# Altium schematic sheet TC264Sheet.SchDoc
size A3
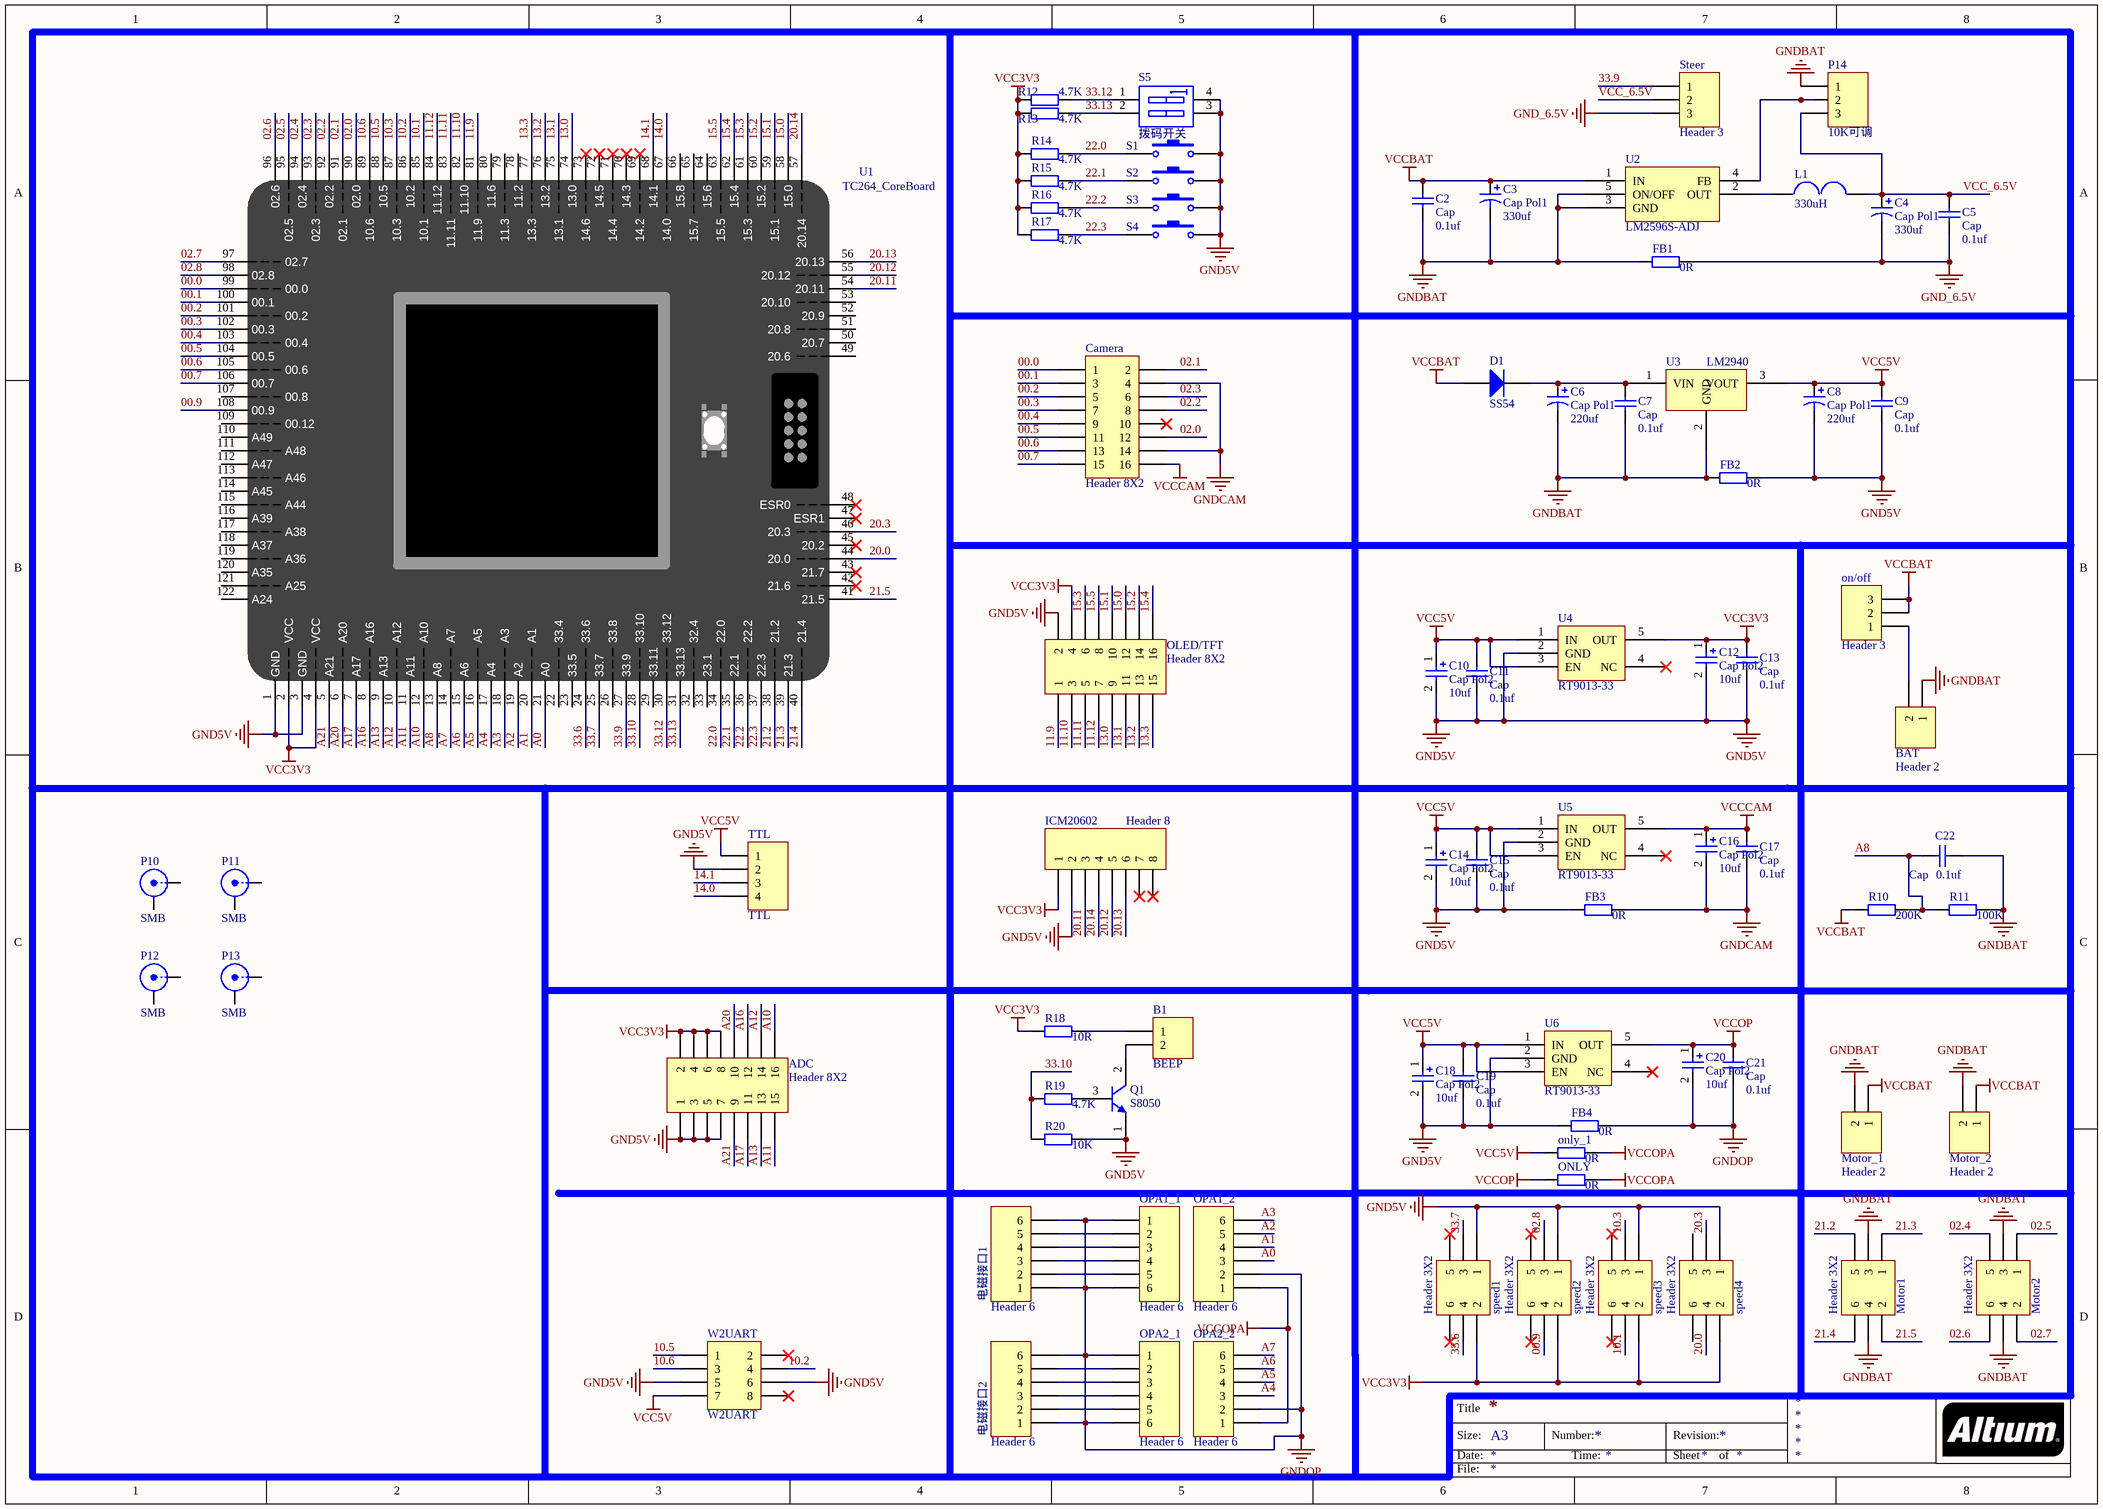
[diagram p0: TC264Sheet.SchDoc]

## Parts
ADC  Header 8X2  [HDR2.54-M-LS-2x8P]
B1  BEEP  [9*11mm有源蜂鸣器]
BAT  Header 2  [电源端口]
C2  Cap  value 0.1uf  [0603电容_]
C3  Cap Pol1  value 330uf  [470UF]
C4  Cap Pol1  value 330uf  [470UF]
C5  Cap  value 0.1uf  [0603电容_]
C6  Cap Pol1  value 220uf  [470UF]
C7  Cap  value 0.1uf  [0603电容_]
C8  Cap Pol1  value 220uf  [470UF]
C9  Cap  value 0.1uf  [0603电容_]
C10  Cap Pol2  value 10uf  [10UF钽电容]
C11  Cap  value 0.1uf  [0603电容_]
C12  Cap Pol2  value 10uf  [10UF钽电容]
C13  Cap  value 0.1uf  [0603电容_]
C14  Cap Pol2  value 10uf  [10UF钽电容]
C15  Cap  value 0.1uf  [0603电容_]
C16  Cap Pol2  value 10uf  [10UF钽电容]
C17  Cap  value 0.1uf  [0603电容_]
C18  Cap Pol2  value 10uf  [10UF钽电容]
C19  Cap  value 0.1uf  [0603电容_]
C20  Cap Pol2  value 10uf  [10UF钽电容]
C21  Cap  value 0.1uf  [0603电容_]
C22  Cap  value 0.1uf  [0603电容_]
Camera  Header 8X2  [HDR2.54-M-LS-2x8P]
D1  SS54  [in5819_SLFK]
FB1  0R  [0603电阻_]
FB2  0R  [0603电阻_]
FB3  0R  [0603电阻_]
FB4  0R  [0603电阻_]
ICM20602  Header 8  [HDR1X8]
L1  330uH  [330uH]
Motor1  Header 3X2  [HDR2.54-M-LS-2x3P]
Motor2  Header 3X2  [HDR2.54-M-LS-2x3P]
Motor_1  Header 2  [电源端口]
Motor_2  Header 2  [电源端口]
OLED/TFT  Header 8X2  [HDR2.54-M-LS-2x8P]
on/off  Header 3  [小扭子开关]
ONLY  0R  [0603电阻_]
only_1  0R  [0603电阻_]
OPA1_1  Header 6  [HDR1X6]
OPA1_2  Header 6  [HDR1X6]
OPA2_1  Header 6  [HDR1X6]
OPA2_2  Header 6  [HDR1X6]
P10  SMB  [螺丝孔]
P11  SMB  [螺丝孔]
P12  SMB  [螺丝孔]
P13  SMB  [螺丝孔]
P14  10K可调  [白兰可调电阻]
Q1  S8050  [SI2302]
R10  200K  [0603电阻_]
R11  100K  [0603电阻_]
R12  4.7K  [0603电阻_]
R13  4.7K  [0603电阻_]
R14  4.7K  [0603电阻_]
R15  4.7K  [0603电阻_]
R16  4.7K  [0603电阻_]
R17  4.7K  [0603电阻_]
R18  10R  [0603电阻_]
R19  4.7K  [0603电阻_]
R20  10K  [0603电阻_]
S1  (no value)  [3*4*2贴片轻触按键]
S2  (no value)  [3*4*2贴片轻触按键]
S3  (no value)  [3*4*2贴片轻触按键]
S4  (no value)  [3*4*2贴片轻触按键]
S5  拨码开关  [2pin拨码开关2.54_SMT]
speed1  Header 3X2  [HDR2.54-M-LS-2x3P]
speed2  Header 3X2  [HDR2.54-M-LS-2x3P]
speed3  Header 3X2  [HDR2.54-M-LS-2x3P]
speed4  Header 3X2  [HDR2.54-M-LS-2x3P]
Steer  Header 3  [HDR1X3]
TTL  TTL  [HDR1X4]
U1  TC264_CoreBoard  [TC264_CoreBoard]
U2  LM2596S-ADJ  [TO263-5]
U3  LM2940  [LM2940-5.0]
U4  RT9013-33  [SOT-23-5]
U5  RT9013-33  [SOT-23-5]
U6  RT9013-33  [SOT-23-5]
W2UART  W2UART  [HDR2.54-M-LS-2x4P]
电磁接口1  Header 6  [HDR1X6]
电磁接口2  Header 6  [HDR1X6]

## Nets
GND5V: ADC.1 ADC.3 ADC.5 ADC.7 C8.2 C9.1 C10.2 C11.1 C12.2 C13.1 C14.2 C15.1 C18.2 C19.1 FB2.2 FB3.1 FB4.1 ICM20602.2 OLED/TFT.2 Q1.1(E) R20.2 S1.2 S2.2 S3.2 S4.2 S5.3(B2) S5.4(B1) speed1.1 speed2.1 speed3.1 speed4.1 TTL.2 U1.1(GND) U1.3(GND) U4.2(GND) U5.2(GND) U6.2(GND) W2UART.5 W2UART.6
GND_6.5V: C4.2 C5.1 FB1.2 Steer.3
GNDBAT: BAT.1 C2.1 C3.2 C6.2 C7.1 C22.1 FB1.1 FB2.1 Motor1.3 Motor1.4 Motor2.3 Motor2.4 Motor_1.2 Motor_2.2 P14.1 R11.2 U2.3(GND) U2.5(ON/OFF) U3.2(GND)
GNDCAM: C16.2 C17.1 Camera.4 Camera.14 FB3.2
GNDOP: C20.2 C21.1 FB4.2 OPA1_1.1 OPA1_1.6 OPA1_2.2 OPA2_1.1 OPA2_1.6 OPA2_2.2 电磁接口1.1 电磁接口1.6 电磁接口2.1 电磁接口2.6
VCC3V3: ADC.2 ADC.4 ADC.6 ADC.8 C12.1 C13.2 ICM20602.1 OLED/TFT.4 R12.1 R13.1 R14.1 R15.1 R16.1 R17.1 R18.1 speed1.2 speed2.2 speed3.2 speed4.2 U1.2(VCC) U1.4(VCC) U4.5(OUT)
VCC5V: C8.1 C9.2 C10.1 C11.2 C14.1 C15.2 C18.1 C19.2 only_1.1 TTL.1 U3.3(VOUT) U4.1(IN) U4.3(EN) U5.1(IN) U5.3(EN) U6.1(IN) U6.3(EN) W2UART.7
VCCBAT: C2.2 C3.1 D1.1(A) Motor_1.1 Motor_2.1 on/off.2 on/off.3 R10.1 U2.1(IN)
VCCCAM: C16.1 C17.2 Camera.16 U5.5(OUT)
VCCOP: C20.1 C21.2 ONLY.1 U6.5(OUT)
VCCOPA: ONLY.2 only_1.2 OPA1_2.1 OPA2_2.1
00.0: Camera.1 U1.99(00.0)
00.1: Camera.3 U1.100(00.1)
00.2: Camera.5 U1.101(00.2)
00.3: Camera.7 U1.102(00.3)
00.4: Camera.9 U1.103(00.4)
00.5: Camera.11 U1.104(00.5)
00.6: Camera.13 U1.105(00.6)
00.7: Camera.15 U1.106(00.7)
00.9: speed2.4 U1.108(00.9)
02.0: Camera.12 U1.90(02.0)
02.1: Camera.2 U1.91(02.1)
02.2: Camera.8 U1.92(02.2)
02.3: Camera.6 U1.93(02.3)
02.4: Motor2.5 U1.94(02.4)
02.5: Motor2.1 U1.95(02.5)
02.6: Motor2.6 U1.96(02.6)
02.7: Motor2.2 U1.97(02.7)
02.8: speed2.3 U1.98(02.8)
10.1: speed3.4 U1.85(10.1)
10.2: U1.86(10.2) W2UART.4
10.3: speed3.3 U1.87(10.3)
10.5: U1.88(10.5) W2UART.1
10.6: U1.89(10.6) W2UART.3
11.9: OLED/TFT.1 U1.81(11.9)
11.10: OLED/TFT.3 U1.82(11.10)
11.11: OLED/TFT.5 U1.83(11.11)
11.12: OLED/TFT.7 U1.84(11.12)
13.0: OLED/TFT.9 U1.74(13.0)
13.1: OLED/TFT.11 U1.75(13.1)
13.2: OLED/TFT.13 U1.76(13.2)
13.3: OLED/TFT.15 U1.77(13.3)
14.0: TTL.4 U1.67(14.0)
14.1: TTL.3 U1.68(14.1)
15.0: OLED/TFT.12 U1.58(15.0)
15.1: OLED/TFT.10 U1.59(15.1)
15.2: OLED/TFT.14 U1.60(15.2)
15.3: OLED/TFT.6 U1.61(15.3)
15.4: OLED/TFT.16 U1.62(15.4)
15.5: OLED/TFT.8 U1.63(15.5)
20.0: speed4.4 U1.44(20.0)
20.3: speed4.3 U1.46(20.3)
20.11: ICM20602.3 U1.54(20.11)
20.12: ICM20602.5 U1.55(20.12)
20.13: ICM20602.6 U1.56(20.13)
20.14: ICM20602.4 U1.57(20.14)
21.2: Motor1.5 U1.38(21.2)
21.3: Motor1.1 U1.39(21.3)
21.4: Motor1.6 U1.40(21.4)
21.5: Motor1.2 U1.41(21.5)
22.0: R14.2 S1.1 U1.34(22.0)
22.1: R15.2 S2.1 U1.35(22.1)
22.2: R16.2 S3.1 U1.36(22.2)
22.3: R17.2 S4.1 U1.37(22.3)
33.6: speed1.4 U1.24(33.6)
33.7: speed1.3 U1.25(33.7)
33.9: Steer.1 U1.27(33.9)
33.10: R19.1 R20.1 U1.28(33.10)
33.12: R12.2 S5.1(A1) U1.30(33.12)
33.13: R13.2 S5.2(A2) U1.31(33.13)
A0: OPA1_2.3 U1.21(A0)
A1: OPA1_2.4 U1.20(A1)
A2: OPA1_2.5 U1.19(A2)
A3: OPA1_2.6 U1.18(A3)
A4: OPA2_2.3 U1.17(A4)
A5: OPA2_2.4 U1.16(A5)
A6: OPA2_2.5 U1.15(A6)
A7: OPA2_2.6 U1.14(A7)
A8: C22.2 R10.2 R11.1 U1.13(A8)
A10: ADC.16 U1.12(A10)
A11: ADC.15 U1.11(A11)
A12: ADC.14 U1.10(A12)
A13: ADC.13 U1.9(A13)
A16: ADC.12 U1.8(A16)
A17: ADC.11 U1.7(A17)
A20: ADC.10 U1.6(A20)
A21: ADC.9 U1.5(A21)
VCC_6.5V: C4.1 C5.2 L1.2 P14.3 Steer.2
NetB1_1: B1.1 R18.2
NetB1_2: B1.2 Q1.2(C)
NetBAT_2: BAT.2 on/off.1
NetC6_1: C6.1 C7.2 D1.2(K) U3.1(VIN)
NetL1_1: L1.1 U2.2(OUT)
NetOPA1_1_2: OPA1_1.2 电磁接口1.5
NetOPA1_1_3: OPA1_1.3 电磁接口1.4
NetOPA1_1_4: OPA1_1.4 电磁接口1.3
NetOPA1_1_5: OPA1_1.5 电磁接口1.2
NetOPA2_1_2: OPA2_1.2 电磁接口2.5
NetOPA2_1_3: OPA2_1.3 电磁接口2.4
NetOPA2_1_4: OPA2_1.4 电磁接口2.3
NetOPA2_1_5: OPA2_1.5 电磁接口2.2
NetP14_2: P14.2 U2.4(FB)
NetQ1_3: Q1.3(B) R19.2

Not connected (* = marked no-connect by the designer): Camera 10*; ICM20602 7* 8*; P10 1(X) 2(Y); P11 1(X) 2(Y); P12 1(X) 2(Y); P13 1(X) 2(Y); speed1 5* 6*; speed2 5* 6*; speed3 5* 6*; speed4 5 6; U1 22(33.4) 23(33.5) 26(33.8) 29(33.11) 32(32.4) 33(23.1) 42(21.6)* 43(21.7)* 45(20.2)* 47(ESR1)* 48(ESR0)* 49(20.6) 50(20.7) 51(20.8) 52(20.9) 53(20.10) 64(15.6) 65(15.7) 66(15.8) 69(14.2)* 70(14.3)* 71(14.4)* 72(14.5)* 73(14.6)* 78(11.2) 79(11.3) 80(11.6) 107(00.8) 109(00.12) 110(A49) 111(A48) 112(A47) 113(A46) 114(A45) 115(A44) 116(A39) 117(A38) 118(A37) 119(A36) 120(A35) 121(A25) 122(A24); U4 4(NC)*; U5 4(NC)*; U6 4(NC)*; W2UART 2* 8*

## Notes on the sheet
- Title
- Size:
- Date:
- A3
- Number:
- Time:
- Revision:
- Sheet
- of
- File:

## Library data of the parts
ADC Camera OLED/TFT = Header 8X2: Header, 8-Pin, Dual row; LatestRevisionDate: 17-Jul-2002; LatestRevisionNote: Re-released for DXP Platform.; Publisher: Altium Limited
B1 BAT Motor_1 Motor_2 = Header 2: Header, 2-Pin; LatestRevisionDate: 17-Jul-2002; LatestRevisionNote: Re-released for DXP Platform.; Publisher: Altium Limited
C2 C5 C7 C9 C11 C13 C15 C17 C19 C21 C22 = Cap: Capacitor; Published: 8-Jun-2000; LatestRevisionDate: 17-Jul-2002; LatestRevisionNote: Re-released for DXP Platform.; PackageReference: RAD-0.3; Publisher: Altium Limited; PackageDescription: Radial Cap, Thru-Hole; 2 Leads; 0.3 in Pin Spacing
C3 C4 C6 C8 = Cap Pol1: Polarized Capacitor (Radial); Published: 8-Jun-2000; LatestRevisionDate: 17-Jul-2002; LatestRevisionNote: Re-released for DXP Platform.; PackageReference: RB7.6-15; Publisher: Altium Limited; PackageDescription: Polarized Capacitor (Radial); 2 Leads
C10 C12 C14 C16 C18 C20 = Cap Pol2: Polarized Capacitor (Axial); Published: 8-Jun-2000; LatestRevisionDate: 17-Jul-2002; LatestRevisionNote: Re-released for DXP Platform.; PackageReference: POLAR0.8; Publisher: Altium Limited; PackageDescription: Polarized Capacitor; 2 Leads
D1 = Diode 1N5404: 3 Amp General Purpose Rectifier; Published: 8-Jun-2000; LatestRevisionDate: 17-Jul-2002; LatestRevisionNote: Re-released for DXP Platform.; DatasheetVersion: 1998; PackageVersion: Aug-1999; PackageReference: DO-201AD; Publisher: Altium Limited; PackageDescription: Diode, Axial; Body 9.5 x 5.6 mm (LxDia. max), Lead Dia. 1.32 mm (max); ComponentLink1Description: Manufacturer Link; ComponentLink1URL: http://www.fairchildsemi.com/; ComponentLink2Description: Datasheet; ComponentLink2URL: http://www.fairchildsemi.com/ds/1N%2F1N5400.pdf
FB1-FB4 ONLY only_1 R10-R20 = Res2: Resistor; Published: 8-Jun-2000; LatestRevisionDate: 17-Jul-2002; LatestRevisionNote: Re-released for DXP Platform.; PackageReference: AXIAL-0.4; Publisher: Altium Limited; PackageDescription: Axial Device, Thru-Hole; 2 Leads; 0.4 in Pin Spacing
ICM20602 = Header 8: Header, 8-Pin; LatestRevisionDate: 17-Jul-2002; LatestRevisionNote: Re-released for DXP Platform.; Publisher: Altium Limited
Motor1 Motor2 speed1-speed4 = Header 3X2: Header, 3-Pin, Dual row; LatestRevisionDate: 17-Jul-2002; LatestRevisionNote: Re-released for DXP Platform.; Publisher: Altium Limited
on/off P14 Steer = Header 3: Header, 3-Pin; LatestRevisionDate: 17-Jul-2002; LatestRevisionNote: Re-released for DXP Platform.; Publisher: Altium Limited
OPA1_1 OPA1_2 OPA2_1 OPA2_2 电磁接口1 电磁接口2 = Header 6: Header, 6-Pin; LatestRevisionDate: 17-Jul-2002; LatestRevisionNote: Re-released for DXP Platform.; Publisher: Altium Limited
P10-P13 = SMB: SMB Straight Connector; LatestRevisionDate: 17-Jul-2002; LatestRevisionNote: Re-released for DXP Platform.; Publisher: Altium Limited
Q1 = 2N3904: NPN General Purpose Amplifier; Published: 8-Jun-2000; LatestRevisionDate: 15-Jan-2003; LatestRevisionNote: PCB Footprint 'BCY-W3/D4.7' replaced; DatasheetVersion: 1997; PackageVersion: Sep-1998; PackageReference: TO-92A; Publisher: Altium Limited; PackageDescription: TO, Flat Index; 3 In-Line, Axial Leads; Body Dia. 4.5mm; Leads 0.51 x 0.48 mm (max); ComponentLink1Description: Manufacturer Link; ComponentLink1URL: http://www.fairchildsemi.com/; ComponentLink2Description: Datasheet; ComponentLink2URL: http://www.fairchildsemi.com/ds/2N%2F2N3904.pdf
S1-S4 = SW-PB: Switch; Published: 24-Mar-1999; LatestRevisionDate: 17-Jul-2002; LatestRevisionNote: Re-released for DXP Platform.; PackageReference: SPST-2; Publisher: Altium Limited; PackageDescription: Switch; 2 Leads
S5 = SW DIP-2: DIP Switch, 2 Position, SPST; Published: 24-Mar-1999; LatestRevisionDate: 17-Jul-2002; LatestRevisionNote: Re-released for DXP Platform.; PackageReference: DIP-4; Publisher: Altium Limited
TTL = Header 4: Header, 4-Pin; LatestRevisionDate: 17-Jul-2002; LatestRevisionNote: Re-released for DXP Platform.; Publisher: Altium Limited
U1 = TC264_CoreBoard: 逐飞科技TC264核心板
U2 = LM2596S
W2UART = Header 4X2: Header, 4-Pin, Dual row; LatestRevisionDate: 17-Jul-2002; LatestRevisionNote: Re-released for DXP Platform.; Publisher: Altium Limited